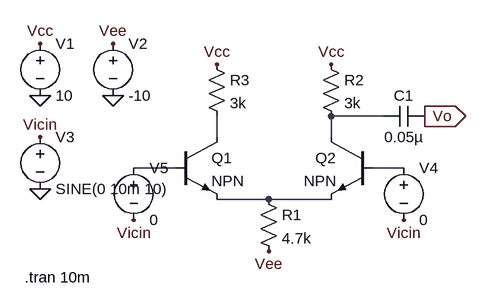
[diagram p0: schematic Draft.asc]
Draft.asc, the LTspice schematic file:
Version 4
SHEET 1 880 680
WIRE 544 240 464 240
WIRE 288 272 288 240
WIRE 464 272 464 240
WIRE 224 320 160 320
WIRE 576 320 528 320
WIRE 368 368 288 368
WIRE 464 368 368 368
FLAG 128 208 0
FLAG 16 208 0
FLAG 16 352 0
FLAG 16 128 Vcc
FLAG 288 160 Vcc
FLAG 128 128 Vee
FLAG 608 240 Vo
IOPIN 608 240 Out
FLAG 576 400 Vicin
FLAG 160 400 Vicin
FLAG 16 272 Vicin
FLAG 368 448 Vee
FLAG 464 160 Vcc
DATAFLAG 480 240 "$"
DATAFLAG 288 240 "$"
DATAFLAG 176 320 "$"
DATAFLAG 560 320 "$"
DATAFLAG 416 368 "$"
SYMBOL voltage 16 112 R0
SYMATTR InstName V1
SYMATTR Value 10
SYMBOL voltage 128 112 R0
SYMATTR InstName V2
SYMATTR Value -10
SYMBOL voltage 16 256 R0
SYMATTR InstName V3
SYMATTR Value SINE(0 10m 10)
SYMBOL res 352 352 R0
SYMATTR InstName R1
SYMATTR Value 4.7k
SYMBOL res 448 144 R0
SYMATTR InstName R2
SYMATTR Value 3k
SYMBOL res 272 144 R0
SYMATTR InstName R3
SYMATTR Value 3k
SYMBOL npn 224 272 R0
SYMATTR InstName Q1
SYMBOL npn 528 272 M0
SYMATTR InstName Q2
SYMBOL cap 608 224 R90
WINDOW 0 0 32 VBottom 2
WINDOW 3 32 32 VTop 2
SYMATTR InstName C1
SYMATTR Value 0.05µ
SYMBOL voltage 576 304 R0
SYMATTR InstName V4
SYMATTR Value 0
SYMBOL voltage 160 304 R0
SYMATTR InstName V5
SYMATTR Value 0
TEXT -8 488 Left 2 !.tran 10m

The netlist it stands for:
* Draft.asc
V1 Vcc 0 10
V2 Vee 0 -10
V3 Vicin 0 SINE(0 10m 10)
R1 N005 Vee 4.7k
R2 Vcc N001 3k
R3 Vcc N002 3k
Q1 N002 N003 N005 0 NPN
Q2 N001 N004 N005 0 NPN
C1 Vo N001 0.05µ
V4 N004 Vicin 0
V5 N003 Vicin 0
.model NPN NPN
.model PNP PNP
.lib standard.bjt
.tran 10m
.backanno
.end